# EasyEDA schematic design_EasyDEA.json
TITLE: S-ADAPT; REV: 1.0; Date: 2026-02-16; Sheet: 1/1; Drawn By: S-ADAPT; Company: KU
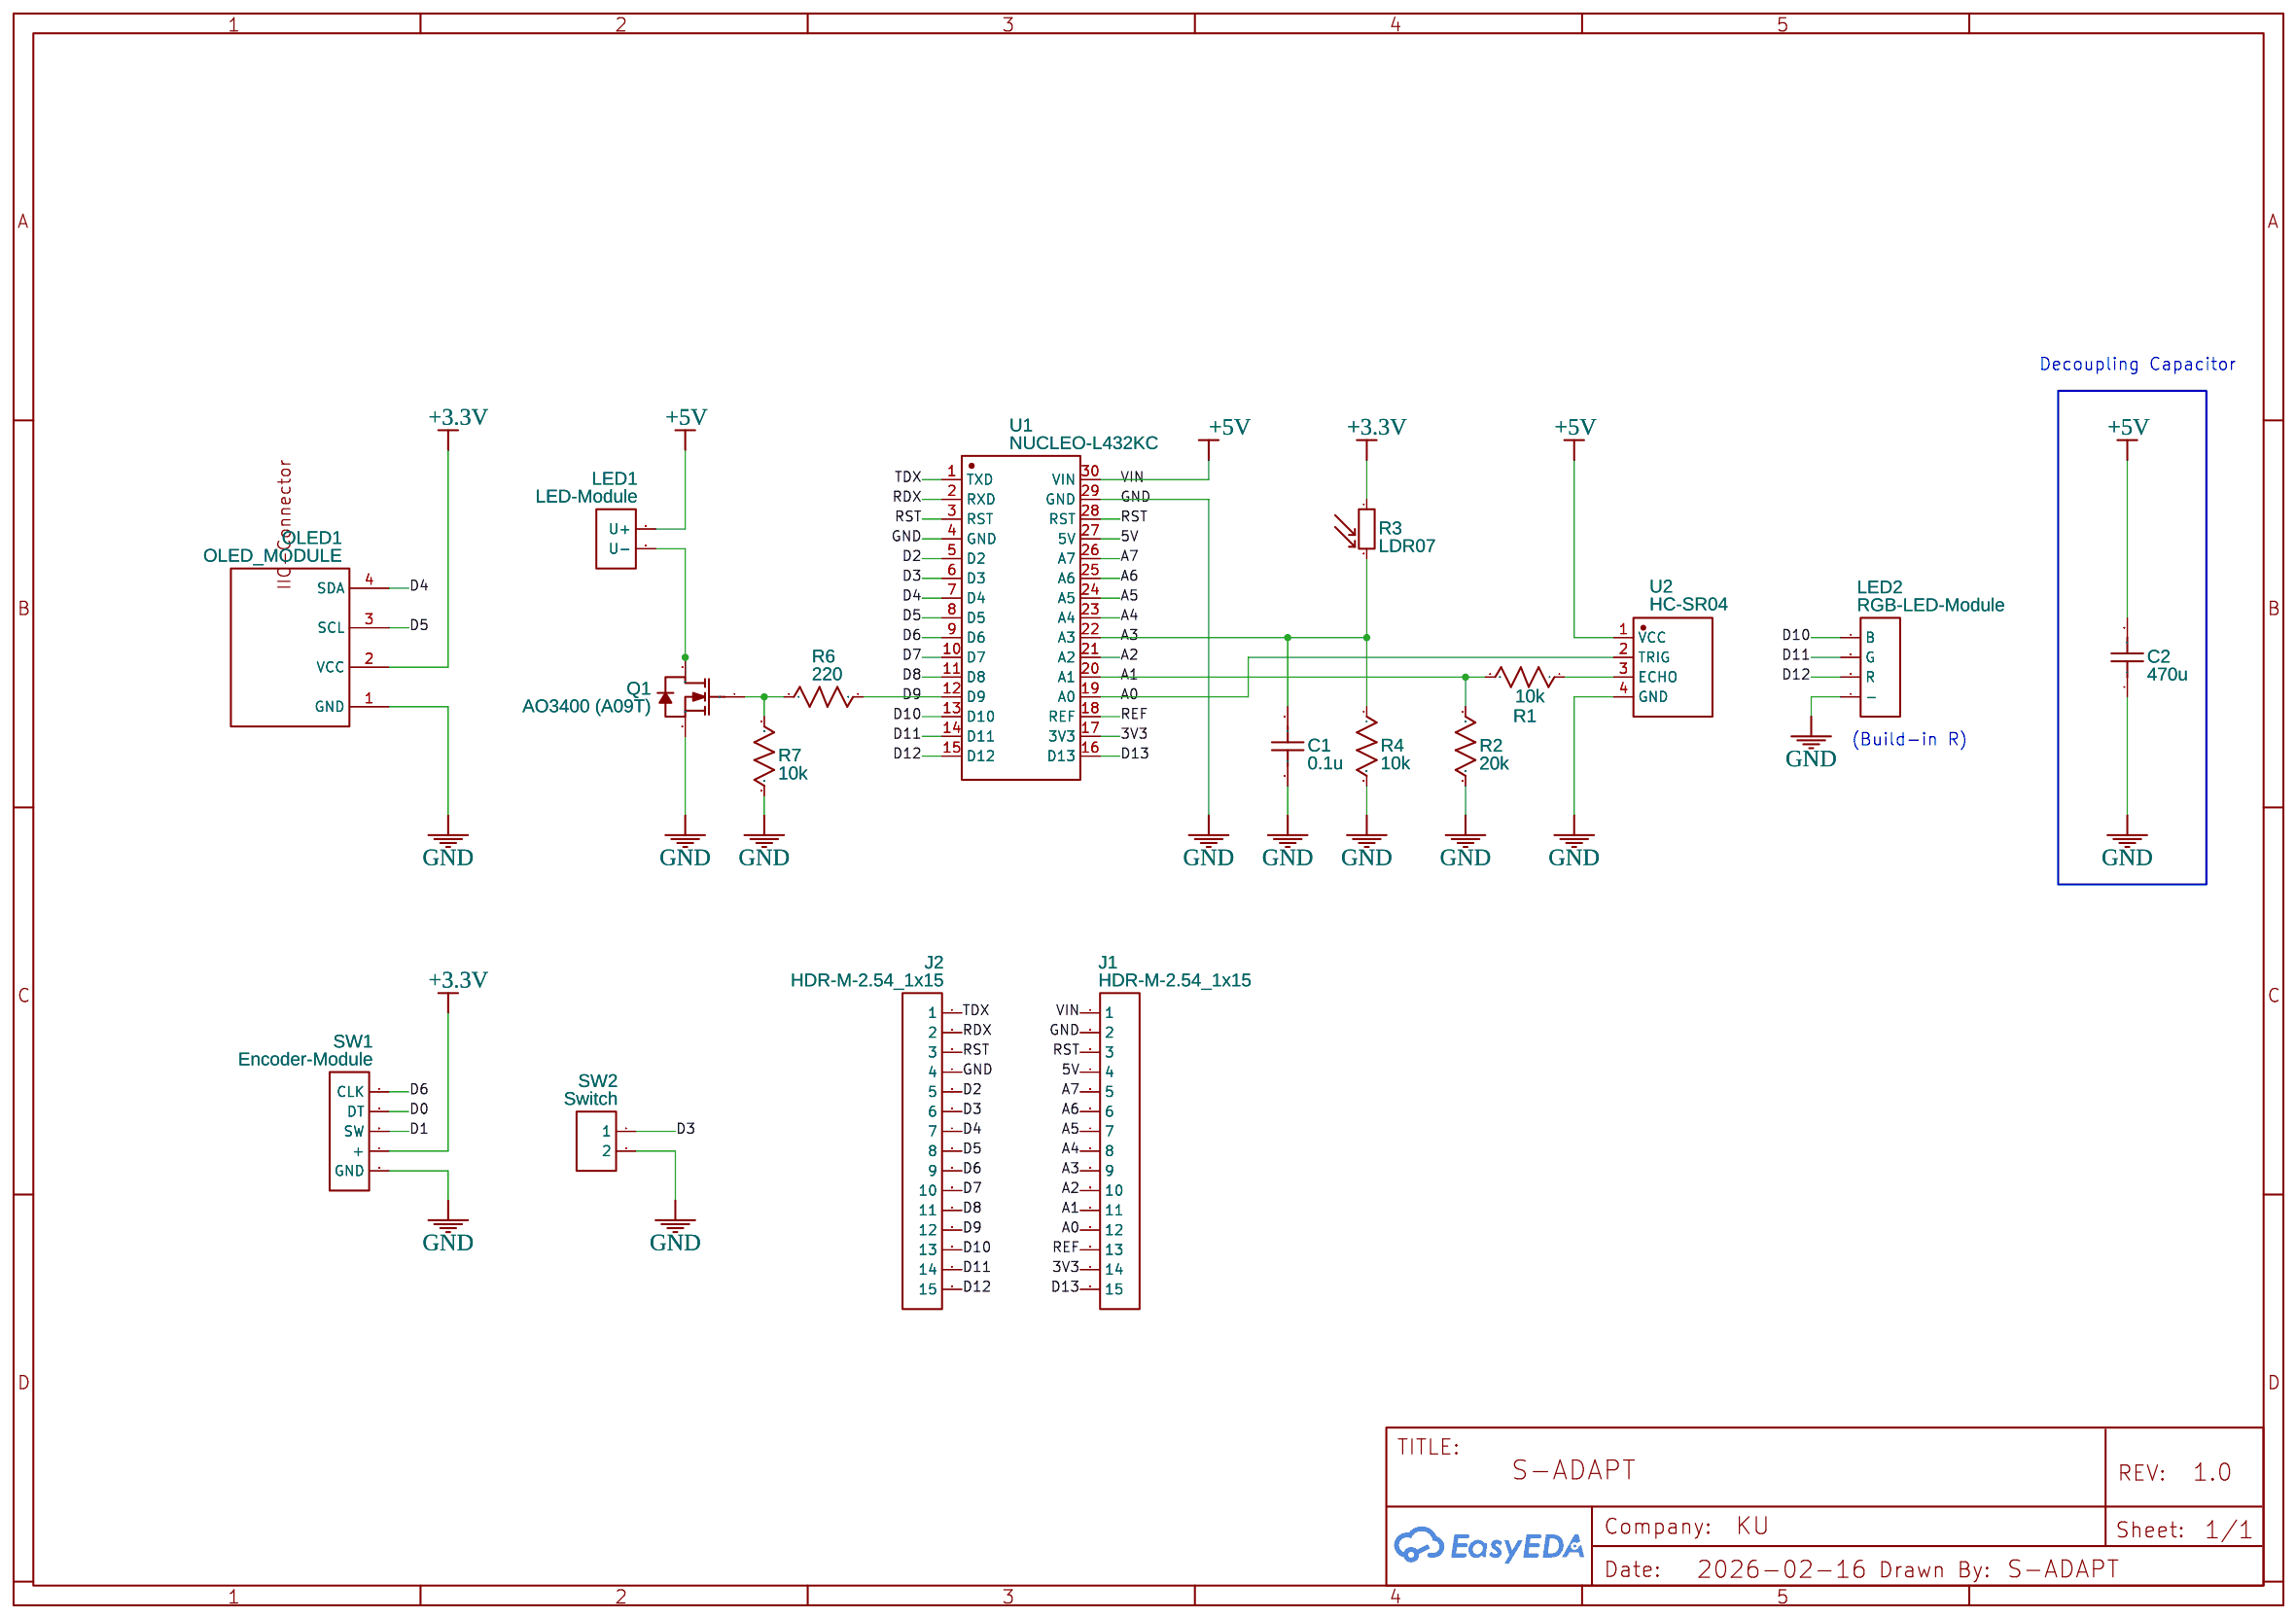
[diagram p0: schematic sheet]

## Parts
C1  0.1u  [C0603]
C2  470u  [C0603]
J1  HDR-M-2.54_1x15  [HDR-M-2.54_1X15]
J2  HDR-M-2.54_1x15  [HDR-M-2.54_1X15]
LED1  LED-Module  [HDR-M-2.54_1X2]
LED2  RGB-LED-Module  [HDR-F-2.54_1X4]
OLED1  OLED_MODULE  [0.96OLED_4P]
Q1  AO3400 (A09T)  [SOT-23-3_L2.9-W1.3-P1.90-LS2.4-BR]
R1  10k  [R0603]
R2  20k  [R0603]
R3  LDR07  [RESISTOR_LDR_5.1X4.3_RM3.4]
R4  10k  [R0603]
R6  220  [R0805]
R7  10k  [R0805]
SW1  Encoder-Module  [HDR-F-2.54_1X5]
SW2  Switch  [HDR-M-2.54_1X2]
U1  NUCLEO-L432KC  [DIP-30_L51.0-W17.8-P2.54-LS15.2-TL]
U2  HC-SR04  [TH_HC-SR04V]

## Library data of the parts
C1 C2 = C_0603_US: Contributor: LCEDA_Lib
J1 J2 = HDR-M-2.54_1x15: Supplier Part: C124373; Supplier: LCSC; Contributor: LCEDA_Lib
LED1 SW2 = HDR-M-2.54_1x2: Supplier Part: C124375; Supplier: LCSC; Contributor: LCEDA_Lib
LED2 = HDR-F-2.54_1x4: Supplier Part: C225501; Supplier: LCSC; Contributor: LCEDA_Lib
OLED1 = 0.96OLED_4P_MODULE_JX: Contributor: LCSC; Supplier: LCSC; Supplier Part: C9900004566; Manufacturer: null; JLCPCB Part Class: Extended Part
Q1 = AO3400NSA: Contributor: lcsc; Supplier: LCSC; Supplier Part: C5456620; Manufacturer: DOWO(东沃); JLCPCB Part Class: Extended Part
R1 R2 R4 = R_0603_US: Contributor: LCEDA_Lib
R3 = LDR07: Contributor: KiCAD; license: https://www.gnu.org/licenses/lgpl-2.1.html
R6 R7 = R_0805_US: Contributor: LCEDA_Lib
SW1 = HDR-F-2.54_1x5: Supplier Part: C50950; Supplier: LCSC; Contributor: LCEDA_Lib
U1 = NUCLEO-L432KC: Supplier: LCSC; Manufacturer: ST(意法半导体); Supplier Part: C94814
U2 = HC-SR04: Supplier: LCSC; Supplier Part: C19857336; Manufacturer: Universal Microelectronics; Contributor: lcsc; JLCPCB Part Class: Extended Part

## Nets
3V3: J1.14 U1.17(3V3)
5V: J1.4 U1.27(5V)
+3.3V: OLED1.2(VCC) R3.1 SW1.4(+)
+5V: C2.2 J1.1 LED1.1(U+) U1.30(VIN) U2.1(VCC)
GND: C1.1 C2.1 J1.2 J2.4 LED2.4(-) OLED1.1(GND) Q1.2(S) R2.1 R4.2 R7.1 SW1.5(GND) SW2.2 U1.4(GND) U1.29(GND) U2.4(GND)
A0: J1.12 U1.19(A0) U2.2(TRIG)
A1: J1.11 R1.2 R2.2 U1.20(A1)
A2: J1.10 U1.21(A2)
A3: C1.2 J1.9 R3.2 R4.1 U1.22(A3)
A4: J1.8 U1.23(A4)
A5: J1.7 U1.24(A5)
A6: J1.6 U1.25(A6)
A7: J1.5 U1.26(A7)
D0: SW1.2(DT)
D1: SW1.3(SW)
D2: J2.5 U1.5(D2)
D3: J2.6 SW2.1 U1.6(D3)
D4: J2.7 OLED1.4(SDA) U1.7(D4)
D5: J2.8 OLED1.3(SCL) U1.8(D5)
D6: J2.9 SW1.1(CLK) U1.9(D6)
D7: J2.10 U1.10(D7)
D8: J2.11 U1.11(D8)
D9: J2.12 R6.2 U1.12(D9)
D10: J2.13 LED2.1(B) U1.13(D10)
D11: J2.14 LED2.2(G) U1.14(D11)
D12: J2.15 LED2.3(R) U1.15(D12)
D13: J1.15 U1.16(D13)
RDX: J2.2 U1.2(RXD)
REF: J1.13 U1.18(REF)
RST: J1.3 J2.3 U1.3(RST) U1.28(RST)
TDX: J2.1 U1.1(TXD)
Net-(LED1-2): LED1.2(U-) Q1.3(D)
Net-(Q1-1): Q1.1(G) R6.1 R7.2
Net-(R1-1): R1.1 U2.3(ECHO)

## Notes on the sheet
- Decoupling Capacitor
- (Build-in R)
